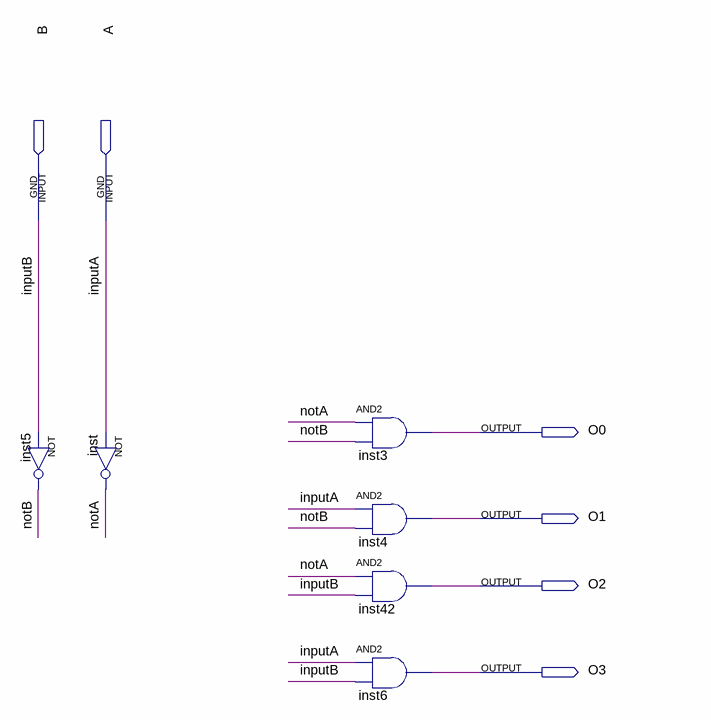
[diagram p0: schematic sheet]
// Quartus schematic decoder.bdf as structural Verilog: 6 symbols, 6 pins
module decoder (
  input  B,
  input  A,
  output O0,
  output O1,
  output O2,
  output O3
);

  wire notA, notB;

  not inst5 (notB, B);
  not inst (notA, A);
  and inst3 (O0, notA, notB);
  and inst4 (O1, A, notB);
  and inst42 (O2, notA, B);
  and inst6 (O3, A, B);

  // Other names for the same wires on the sheet: inputA = A; inputB = B
endmodule
